# EAGLE board ADS1299-shield (EAGLE 6.5.0)
PCB Matrix Packages
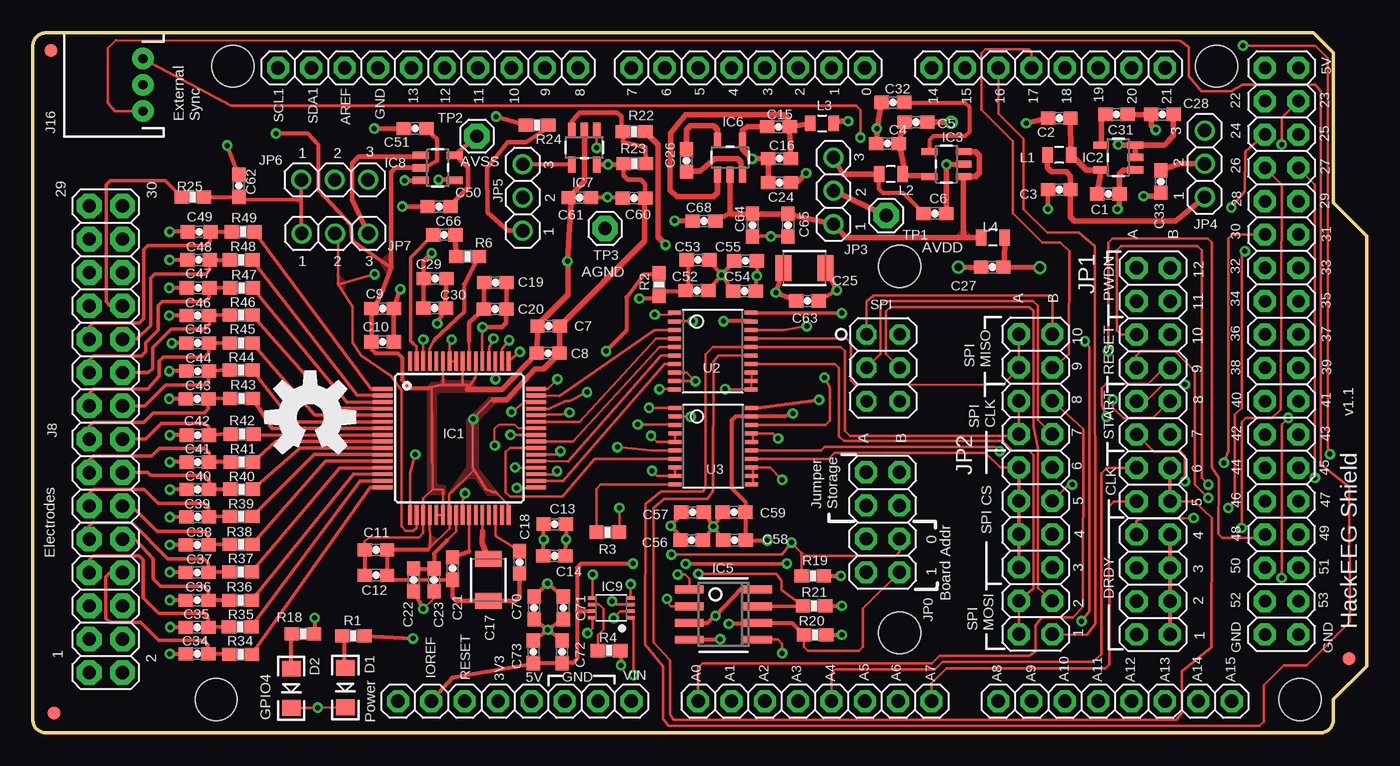
[diagram p3: board, top side]
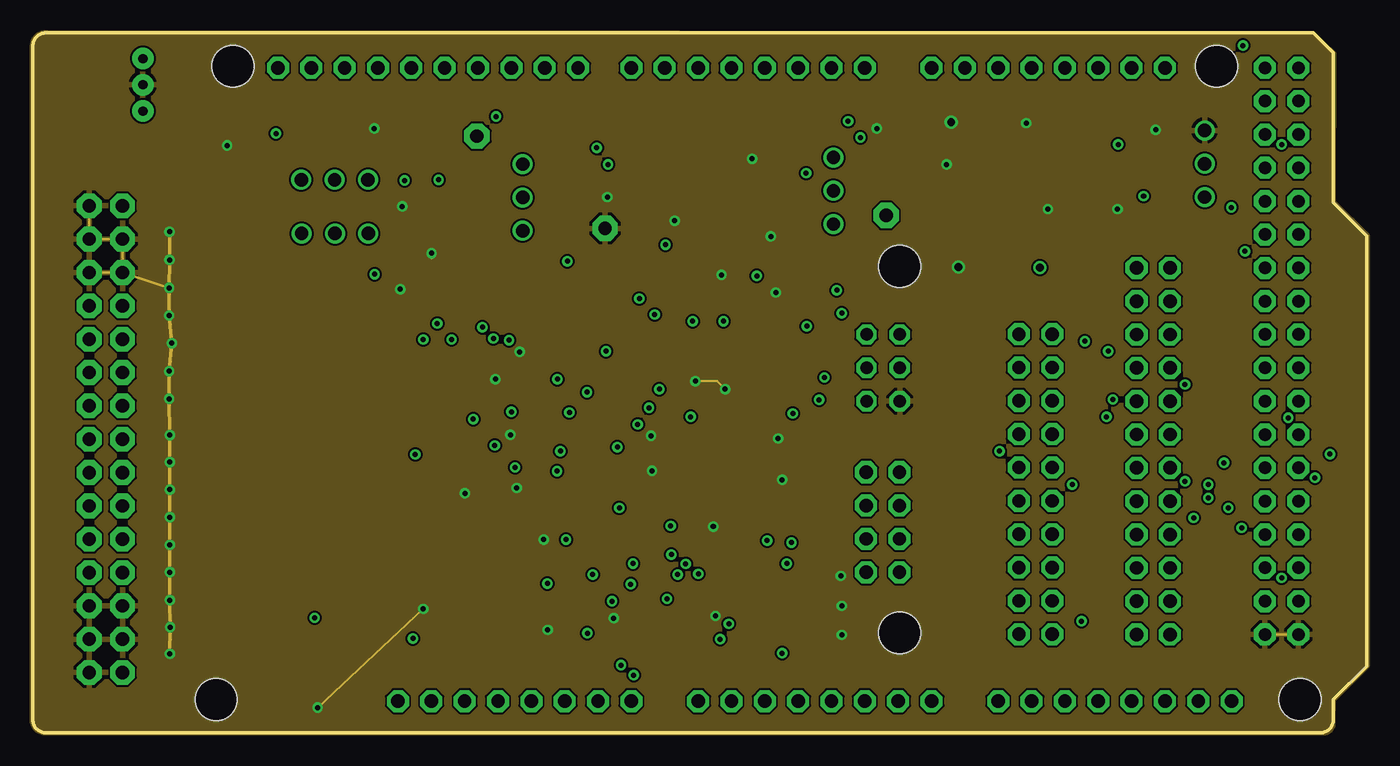
[diagram p4: board, inner layer AGND]
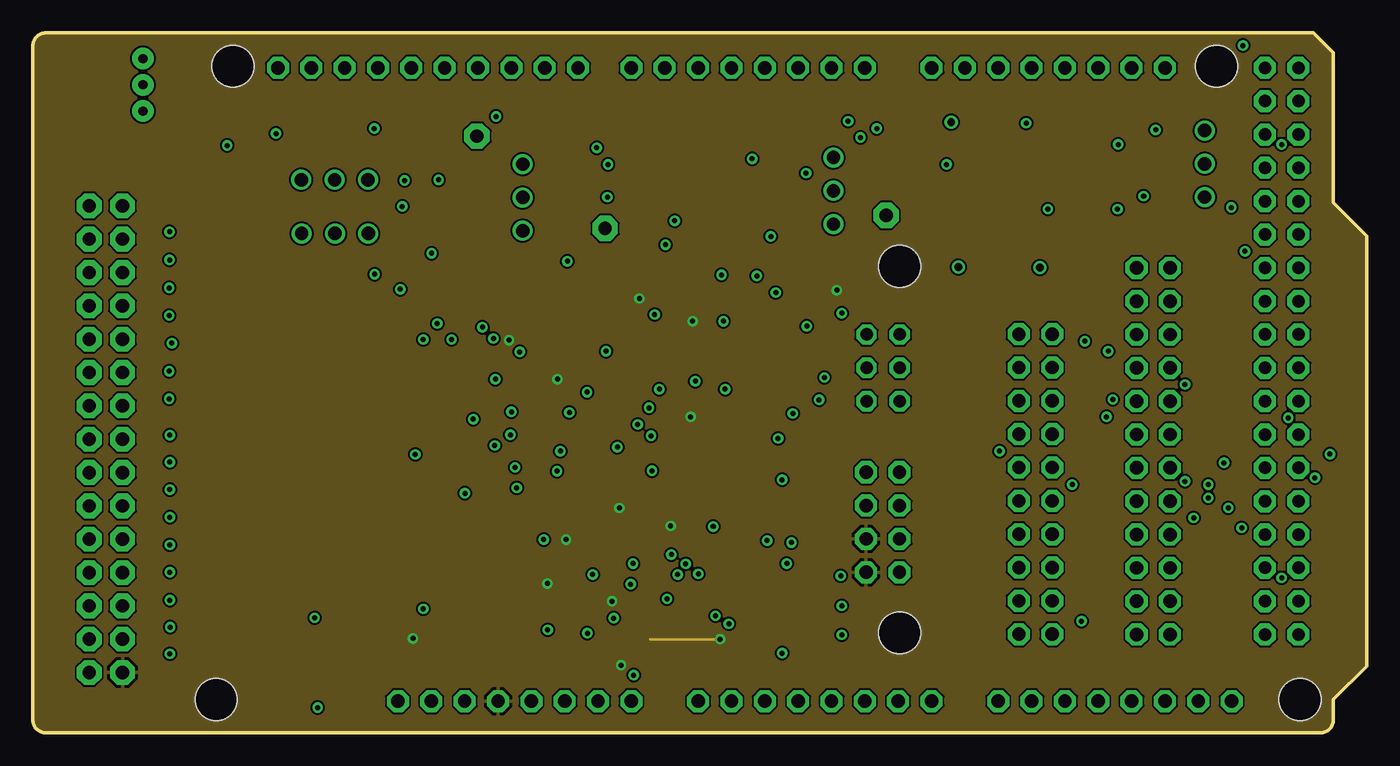
[diagram p5: board, inner layer DVDD]
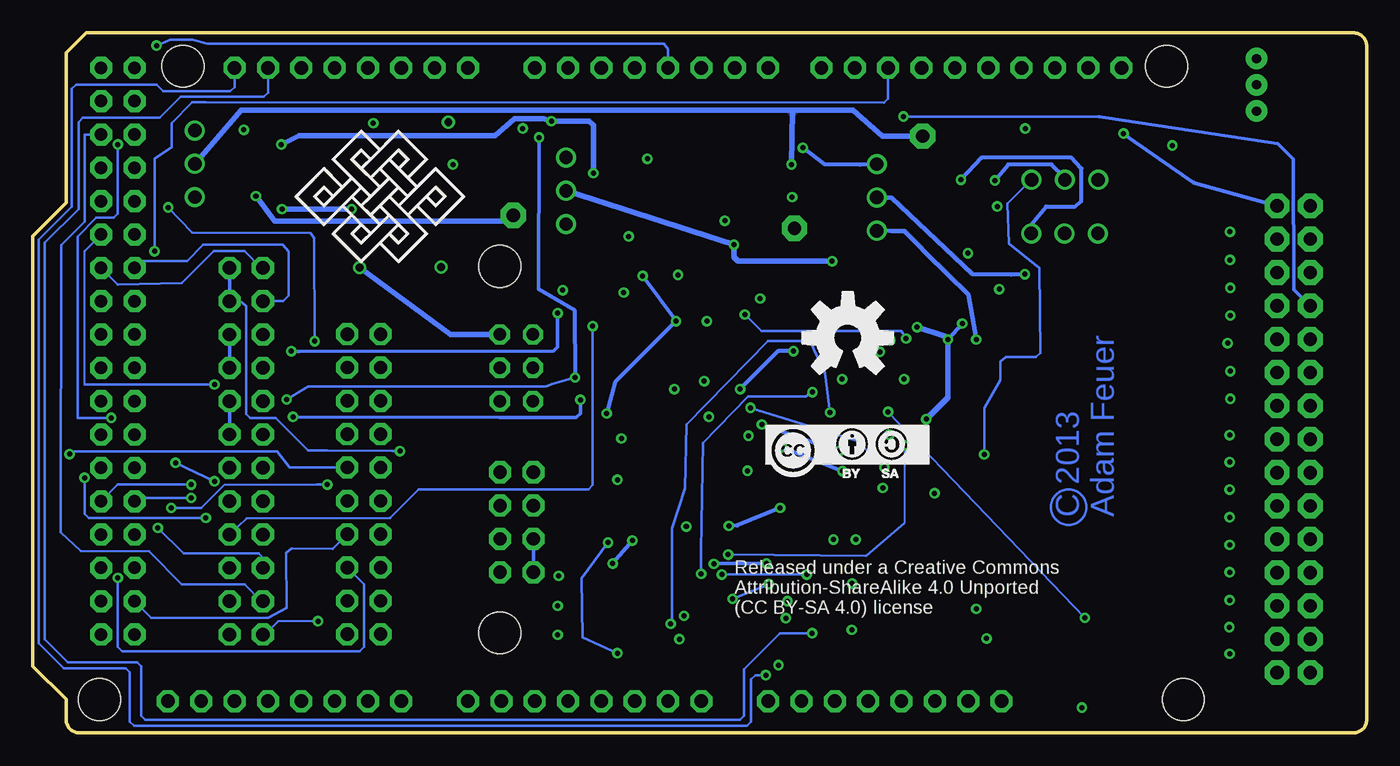
[diagram p6: board, bottom side, seen from below]

Size 101.6 x 53.34 mm. Coordinates in mm from the lower left corner, seen from the top.
Outline: 97.54,53.34 99.06,51.82 99.06,40.39 101.6,37.85 101.6,5.08 99.06,2.54 99.06,1 arc-90 98.06,0 1,0 arc-90 0,1 0,52.34 arc-90 1,53.34 97.54,53.34
Copper layers (1*2+15*16): Top 0.034290625mm / dielectric 12mil / AGND 0.034290625mm / dielectric 59mil / DVDD 0.03301875mm / dielectric 12mil / Bottom 0.034290625mm
Design rules "advanced-circuits-4-layer": minimum track width 6mil, minimum drill 15mil, track to track 6mil, track to pad 6mil, pad to pad 6mil, via to via 6mil, smd to smd 6mil, copper to edge 0mil, drill to drill 6mil, minimum pad ring 10mil, minimum via ring 8mil, stop-mask expansion 4mil, vias tented up to drill 16mil, thermal gap 10mil
Holes 3.2 mm at 96.52,2.54 15.24,50.8 90.17,50.8 13.97,2.54 66.04,35.56 66.04,7.62

## Footprints (pad centres in the part's own frame; a part is rotated, then mirrored left to right if it is on the bottom)
0603-CAP = smd 1.1 x 1: 1 -0.85,0; 2 0.85,0
1210 = smd 1.2 x 2: 1 -1.6,0; 2 1.6,0
LED-1206 = smd 1.2 x 1.4: A -1.5,0; C 1.5,0
TQFP64 = smd 1.5 x 0.285: 1 -5.85,3.75; 2 -5.85,3.25; 3 -5.85,2.75; 4 -5.85,2.25; 5 -5.85,1.75; 6 -5.85,1.25; 7 -5.85,0.75; 8 -5.85,0.25; 9 -5.85,-0.25; 10 -5.85,-0.75; 11 -5.85,-1.25; 12 -5.85,-1.75; 13 -5.85,-2.25; 14 -5.85,-2.75; 15 -5.85,-3.25; 16 -5.85,-3.75; 33 5.85,-3.75; 34 5.85,-3.25; 35 5.85,-2.75; 36 5.85,-2.25; 37 5.85,-1.75; 38 5.85,-1.25; 39 5.85,-0.75; 40 5.85,-0.25; 41 5.85,0.25; 42 5.85,0.75; 43 5.85,1.25; 44 5.85,1.75; 45 5.85,2.25; 46 5.85,2.75; 47 5.85,3.25; 48 5.85,3.75 | smd 0.285 x 1.5: 17 -3.75,-5.85; 18 -3.25,-5.85; 19 -2.75,-5.85; 20 -2.25,-5.85; 21 -1.75,-5.85; 22 -1.25,-5.85; 23 -0.75,-5.85; 24 -0.25,-5.85; 25 0.25,-5.85; 26 0.75,-5.85; 27 1.25,-5.85; 28 1.75,-5.85; 29 2.25,-5.85; 30 2.75,-5.85; 31 3.25,-5.85; 32 3.75,-5.85; 49 3.75,5.85; 50 3.25,5.85; 51 2.75,5.85; 52 2.25,5.85; 53 1.75,5.85; 54 1.25,5.85; 55 0.75,5.85; 56 0.25,5.85; 57 -0.25,5.85; 58 -0.75,5.85; 59 -1.25,5.85; 60 -1.75,5.85; 61 -2.25,5.85; 62 -2.75,5.85; 63 -3.25,5.85; 64 -3.75,5.85
SOT23-5 = smd 0.55 x 1.2: 1 -0.95,-1.3; 2 0,-1.3; 3 0.95,-1.3; 4 0.95,1.3; 5 -0.95,1.3
SO-08 = smd 0.6 x 2.2: 1 -1.905,-2.6; 2 -0.635,-2.6; 3 0.635,-2.6; 4 1.905,-2.6; 5 1.905,2.6; 6 0.635,2.6; 7 -0.635,2.6; 8 -1.905,2.6
VFSOP-8 = smd 0.25 x 0.65: P$1 -0.75,-1.45; P$2 -0.25,-1.45; P$3 0.25,-1.45; P$4 0.75,-1.45; P$5 0.75,1.45; P$6 0.25,1.45; P$7 -0.25,1.45; P$8 -0.75,1.45
2X15 = drill 1.016 pad 1.88 octagon: 1 -17.78,-1.27; 2 -17.78,1.27; 3 -15.24,-1.27; 4 -15.24,1.27; 5 -12.7,-1.27; 6 -12.7,1.27; 7 -10.16,-1.27; 8 -10.16,1.27; 9 -7.62,-1.27; 10 -7.62,1.27; 11 -5.08,-1.27; 12 -5.08,1.27; 13 -2.54,-1.27; 14 -2.54,1.27; 15 0,-1.27; 16 0,1.27; 17 2.54,-1.27; 18 2.54,1.27; 19 5.08,-1.27; 20 5.08,1.27; 21 7.62,-1.27; 22 7.62,1.27; 23 10.16,-1.27; 24 10.16,1.27; 25 12.7,-1.27; 26 12.7,1.27; 27 15.24,-1.27; 28 15.24,1.27; 29 17.78,-1.27; 30 17.78,1.27
JST-3-PTH = drill 0.7 pad 1.626: 1 -2,0; 2 0,0; 3 2,0
2X04 = drill 1.016 pad 1.676 octagon: 1 -3.81,-1.27; 2 -3.81,1.27; 3 -1.27,-1.27; 4 -1.27,1.27; 5 1.27,-1.27; 6 1.27,1.27; 7 3.81,-1.27; 8 3.81,1.27
2X12 = drill 1.016 pad 1.676 octagon: 1 -12.7,1.27; 2 -12.7,3.81; 3 -10.16,1.27; 4 -10.16,3.81; 5 -7.62,1.27; 6 -7.62,3.81; 7 -5.08,1.27; 8 -5.08,3.81; 9 -2.54,1.27; 10 -2.54,3.81; 11 0,1.27; 12 0,3.81; 13 2.54,1.27; 14 2.54,3.81; 15 5.08,1.27; 16 5.08,3.81; 17 7.62,1.27; 18 7.62,3.81; 19 10.16,1.27; 20 10.16,3.81; 21 12.7,1.27; 22 12.7,3.81; 23 15.24,1.27; 24 15.24,3.81
2X10 = drill 1.016 pad 1.676 octagon: 1 -11.43,-1.27; 2 -11.43,1.27; 3 -8.89,-1.27; 4 -8.89,1.27; 5 -6.35,-1.27; 6 -6.35,1.27; 7 -3.81,-1.27; 8 -3.81,1.27; 9 -1.27,-1.27; 10 -1.27,1.27; 11 1.27,-1.27; 12 1.27,1.27; 13 3.81,-1.27; 14 3.81,1.27; 15 6.35,-1.27; 16 6.35,1.27; 17 8.89,-1.27; 18 8.89,1.27; 19 11.43,-1.27; 20 11.43,1.27
1X03 = drill 1.016: 1 -2.54,0; 2 0,0; 3 2.54,0
1X10 = drill 1.016 pad 1.676 octagon: 1 -11.43,0; 2 -8.89,0; 3 -6.35,0; 4 -3.81,0; 5 -1.27,0; 6 1.27,0; 7 3.81,0; 8 6.35,0; 9 8.89,0; 10 11.43,0
1X08 = drill 1.016 pad 1.676 octagon: 1 -8.89,0; 2 -6.35,0; 3 -3.81,0; 4 -1.27,0; 5 1.27,0; 6 3.81,0; 7 6.35,0; 8 8.89,0
2X18 = drill 0.95 pad 1.676 octagon: 1 -21.59,-1.27; 2 -21.59,1.27; 3 -19.05,-1.27; 4 -19.05,1.27; 5 -16.51,-1.27; 6 -16.51,1.27; 7 -13.97,-1.27; 8 -13.97,1.27; 9 -11.43,-1.27; 10 -11.43,1.27; 11 -8.89,-1.27; 12 -8.89,1.27; 13 -6.35,-1.27; 14 -6.35,1.27; 15 -3.81,-1.27; 16 -3.81,1.27; 17 -1.27,-1.27; 18 -1.27,1.27; 19 1.27,-1.27; 20 1.27,1.27; 21 3.81,-1.27; 22 3.81,1.27; 23 6.35,-1.27; 24 6.35,1.27; 25 8.89,-1.27; 26 8.89,1.27; 27 11.43,-1.27; 28 11.43,1.27; 29 13.97,-1.27; 30 13.97,1.27; 31 16.51,-1.27; 32 16.51,1.27; 33 19.05,-1.27; 34 19.05,1.27; 35 21.59,-1.27; 36 21.59,1.27
0805 = smd 0.8 x 1.2: 1 -0.9,0; 2 0.9,0
0603-RES = smd 1.1 x 1: 1 -0.85,0; 2 0.85,0
2X03 = drill 0.95 pad 1.55 octagon: 1 -2.54,-1.27; 2 -2.54,1.27; 3 0,-1.27; 4 0,1.27; 5 2.54,-1.27; 6 2.54,1.27
1X01 = drill 1.016 pad 1.93 octagon: 1 0,0
TSSOP20 = smd 0.305 x 0.991: 1 -2.925,-2.918; 2 -2.275,-2.918; 3 -1.625,-2.918; 4 -0.975,-2.918; 5 -0.325,-2.918; 6 0.325,-2.918; 7 0.975,-2.918; 8 1.625,-2.918; 9 2.275,-2.918; 10 2.925,-2.918; 11 2.925,2.918; 12 2.275,2.918; 13 1.625,2.918; 14 0.975,2.918; 15 0.325,2.918; 16 -0.325,2.918; 17 -0.975,2.918; 18 -1.625,2.918; 19 -2.275,2.918; 20 -2.925,2.918
FIDUCIAL_1MM = smd 1 x 1: 1 0,0

## Placement (x,y rotation side)
C1  2.2uF  [0603-CAP]  81.92,41.07 0 top
C2  10 uF  [0603-CAP]  78.18,46.84 180 top
C3  10uF  [0603-CAP]  78.18,41.4 180 top
C4  2.2uF  [0603-CAP]  65.1,44.91 180 top
C5  10 uF  [0603-CAP]  67.26,46.53 0 top
C6  10uf  [0603-CAP]  68.71,39.57 0 top
C7  1uF  [0603-CAP]  39.29,30.99 0 top
C8  0.1uF  [0603-CAP]  39.24,28.93 0 top
C9  1uF  [0603-CAP]  26.64,32.33 0 top
C10  0.1uF  [0603-CAP]  26.64,29.79 0 top
C11  1uF  [0603-CAP]  26.14,13.94 0 top
C12  0.1uF  [0603-CAP]  26.14,12.01 0 top
C13  1uF  [0603-CAP]  39.75,15.9 180 top
C14  0.1uF  [0603-CAP]  39.73,13.49 180 top
C15  1uF  [0603-CAP]  56.79,46.18 180 top
C16  10 uF  [0603-CAP]  56.87,43.76 180 top
C17  100uF  [1210]  34.7,11.66 270 top
C18  1uF  [0603-CAP]  37.08,13 270 top
C19  1uF  [0603-CAP]  35.23,34.32 0 top
C20  0.1uF  [0603-CAP]  35.2,32.28 0 top
C21  1uF  [0603-CAP]  31.98,12.52 270 top
C22  1uF  [0603-CAP]  29.01,11.66 270 top
C23  1uF  [0603-CAP]  30.56,11.66 270 top
C24  10uf  [0603-CAP]  56.87,41.94 180 top
C25  100uF  [1210]  58.78,35.41 180 top
C26  1uF  [0603-CAP]  49.78,43.61 90 top
C27  10uf  [0603-CAP]  73.08,35.48 180 top
C28  2.2uF  [0603-CAP]  86.03,47.12 180 top
C29  1uF  [0603-CAP]  30.63,34.62 0 top
C30  1uF  [0603-CAP]  30.61,32.36 0 top
C31  0.01uF  [0603-CAP]  82.55,47.12 0 top
C32  1uF  [0603-CAP]  65.51,48.03 180 top
C33  0.1uF  [0603-CAP]  85.93,42.01 90 top
C34  4.7nF  [0603-CAP]  12.52,6.02 180 top
C35  4.7nF  [0603-CAP]  12.52,8.05 0 top
C36  4.7nF  [0603-CAP]  12.52,10.11 180 top
C37  4.7nF  [0603-CAP]  12.52,12.22 0 top
C38  4.7nF  [0603-CAP]  12.52,14.33 180 top
C39  4.7nF  [0603-CAP]  12.55,16.46 0 top
C40  4.7nF  [0603-CAP]  12.57,18.54 180 top
C41  4.7nF  [0603-CAP]  12.57,20.62 0 top
C42  4.7nF  [0603-CAP]  12.57,22.68 180 top
C43  4.7nF  [0603-CAP]  12.52,25.45 0 top
C44  4.7nF  [0603-CAP]  12.55,27.56 180 top
C45  4.7nF  [0603-CAP]  12.55,29.69 0 top
C46  4.7nF  [0603-CAP]  12.57,31.8 180 top
C47  4.7nF  [0603-CAP]  12.6,33.91 0 top
C48  4.7nF  [0603-CAP]  12.62,36.04 180 top
C49  4.7nF  [0603-CAP]  12.67,38.18 0 top
C50  1uF  [0603-CAP]  30.94,40.11 180 top
C51  1uF  [0603-CAP]  29.11,46.05 0 top
C52  1uF  [0603-CAP]  50.6,33.71 180 top
C53  0.1uF  [0603-CAP]  50.67,36.04 180 top
C54  1uF  [0603-CAP]  54.2,33.65 0 top
C55  0.1uF  [0603-CAP]  54.28,35.97 0 top
C56  1uF  [0603-CAP]  50.19,14.68 180 top
C57  0.1uF  [0603-CAP]  50.24,16.81 180 top
C58  1uF  [0603-CAP]  53.44,14.68 0 top
C59  0.1uF  [0603-CAP]  53.42,16.81 0 top
C60  1uF  [0603-CAP]  45.8,40.74 180 top
C61  1uF  [0603-CAP]  41.66,40.79 180 top
C62  4.7nF  [0603-CAP]  15.7,41.68 90 top
C63  0.1uF  [0603-CAP]  59,32.92 180 top
C64  10uF  [0603-CAP]  54.81,38.68 270 top
C65  1 uF  [0603-CAP]  57.53,38.68 270 top
C66  0.01uF  [0603-CAP]  31.34,37.95 0 top
C68  1uF  [0603-CAP]  51.13,38.99 180 top
C70  1uF  [0603-CAP]  38.18,9.52 90 top
C71  0.1uF  [0603-CAP]  40.41,9.52 90 top
C72  1uF  [0603-CAP]  40.31,6.17 270 top
C73  0.1uF  [0603-CAP]  38.13,6.17 270 top
D1  RED  [LED-1206]  23.8,3.45 270 top
D2  WHITE  [LED-1206]  19.69,3.4 270 top
IC1  ADS1299IPAG  [TQFP64]  32.49,22.45 0 top
IC2  TPS72325DBVT  [SOT23-5]  82.68,43.84 90 top
IC3  TPS73225DBVT  [SOT23-5]  69.6,43.33 90 top
IC5  24AA256UID  [SO-08]  52.6,9.02 90 top
IC6  TPS60403DBVT  [SOT23-5]  53.11,43.84 0 top
IC7  OPA376DBV  [SOT23-5]  42.01,44.6 180 top
IC8  OPA376DBV  [SOT23-5]  30.84,43.05 270 top
IC9  TXS0102DCUR  [VFSOP-8]  44.07,9.52 90 top
J8  Electrode Connector  [2X15]  5.56,22.38 90 top
J16  EXTERNAL_SYNC  [JST-3-PTH]  8.38,49.38 90 top
JP0  BOARD_ADDRESS  [2X04]  64.74,16.05 90 top
JP1  CONFIG1  [2X12]  87.88,20.19 90 top
JP2  CONFIG0  [2X10]  76.38,18.95 270 top
JP3  5V-2.5V  [1X03]  60.99,41.3 90 top
JP4  -2.5V-GND  [1X03]  89.26,43.36 90 top
JP5  SRB1-BIAS  [1X03]  37.31,40.79 90 top
JP6  SRB2-REF_ELEC  [1X03]  22.99,42.14 0 top
JP7  SRB1-REF_ELEC  [1X03]  23.01,38.05 0 top
JP8  PWMH  [1X10]  30.1,50.67 0 top
JP9  PWML  [1X08]  54.48,50.67 0 top
JP10  COMMUNICATION  [1X08]  77.34,50.67 0 top
JP11  XIO  [2X18]  95.12,29.08 270 top
JP12  ADCH  [1X08]  82.42,2.41 0 top
JP13  ADCL  [1X08]  59.56,2.41 0 top
JP14  POWER  [1X08]  36.7,2.41 0 top
L1  3.3 uH  [0805]  78.18,44.04 180 top
L2  3.3 uH  [0805]  65.35,42.57 180 top
L3  3.3 uH  [0805]  60.12,46.43 0 top
L4  3.3 uH  [0805]  73.13,37.74 180 top
R1  270  [0603-RES]  24.41,7.39 180 top
R2  10k  [0603-RES]  47.7,34.16 90 top
R3  10k  [0603-RES]  43.79,15.29 180 top
R4  10k  [0603-RES]  43.89,6.27 180 top
R6  3.98K  [0603-RES]  33.12,36.3 0 top
R18  270  [0603-RES]  20.57,7.54 180 top
R19  10k  [0603-RES]  59.41,11.96 180 top
R20  10k  [0603-RES]  59.59,7.47 180 top
R21  10k  [0603-RES]  59.51,9.68 180 top
R22  2M  [0603-RES]  45.8,45.8 0 top
R23  2M  [0603-RES]  45.85,43.38 0 top
R24  4.99k  [0603-RES]  38.4,46.3 0 top
R25  4.99k  [0603-RES]  12.19,40.82 180 top
R34  4.99k  [0603-RES]  15.82,5.99 180 top
R35  4.99k  [0603-RES]  15.8,8.08 180 top
R36  4.99k  [0603-RES]  15.82,10.11 180 top
R37  4.99k  [0603-RES]  15.82,12.27 180 top
R38  4.99k  [0603-RES]  15.87,14.35 180 top
R39  4.99k  [0603-RES]  15.87,16.48 180 top
R40  4.99k  [0603-RES]  15.9,18.57 180 top
R41  4.99k  [0603-RES]  15.93,20.62 180 top
R42  4.99k  [0603-RES]  15.95,22.76 180 top
R43  4.99k  [0603-RES]  15.9,25.48 180 top
R44  4.99k  [0603-RES]  15.87,27.64 180 top
R45  4.99k  [0603-RES]  15.87,29.69 180 top
R46  4.99k  [0603-RES]  15.87,31.83 180 top
R47  4.99k  [0603-RES]  15.9,33.91 180 top
R48  4.99k  [0603-RES]  15.87,36.04 180 top
R49  4.99k  [0603-RES]  16.03,38.18 180 top
SPI  SPI  [2X03]  64.77,27.81 270 top
TP1  AVDD_TEST_POINT  [1X01]  65,39.42 90 top
TP2  AVSS_TEST_POINT  [1X01]  33.83,45.47 0 top
TP3  AGND_TEST_POINT  [1X01]  43.59,38.43 0 top
U2  TXB0108PWR  [TSSOP20]  51.79,29.08 270 top
U3  TXB0108PWR  [TSSOP20]  51.82,21.84 270 top
U$1  [OSHW-LOGO-L]  21.13,24.05 0 top
U$2  FIDUCIAL  [FIDUCIAL_1MM]  1.6,1.5 0 top
U$3  [CC-BY-SA]  45.9,19.15 0 bottom
U$4  [OSHW-LOGO-L]  39.52,30.1 0 bottom
U$5  FIDUCIAL  [FIDUCIAL_1MM]  1.37,51.99 0 top
U$6  FIDUCIAL  [FIDUCIAL_1MM]  100.25,5.66 0 top
U$7  [ENDLESSKNOT-MEDIUM]  75.06,40.82 0 bottom

## Tracks (layer width: path | path; a pad name or v marks a point on that pad's centre or on a via)
!ADC_CS_0  (via drill 0.38)
  Top 0.203: v92.18,52.38 97.69,52.35 98.63,51.41 98.63,21.64 v98.81,21.23
  Bottom 0.203: JP9.4 53.21,52.08 53.5,52.5 88.32,52.5 89.41,52.81 91.14,52.81 v92.18,52.38 | v98.81,21.23 98.48,21.44 83.01,21.44 82.04,20.22 JP2.10
!ADC_CS_1  (via drill 0.38)
  Top 0.152: v92.33,36.7 92.08,36.45
  Top 0.203: v79.17,18.92 78.77,18.8 JP2.12 | v91.06,17.14 91.57,17.65 91.57,24.26 92.08,24.77 92.08,36.45
  Bottom 0.152: 79.88,18.92 87,18.92 88.77,17.14
  Bottom 0.203: JP8.8 36.45,48.32 36.77,48.01 88.42,48.06 89.45,48.06 91.03,46.47 91.03,44.61 92.33,43.75 v92.33,36.7 | 79.96,18.92 79.88,18.92 v79.17,18.92 | v91.06,17.14 88.77,17.14
!ADC_CS_2
  Bottom 0.203: JP2.14 78.77,14.02 81.9,14.05 82.3,13.73 82.27,9.52 83.69,8.76 92.58,8.76 JP11.33
!ADC_CS_3  (via drill 0.38)
  Top 0.203: JP11.4 95.12,46.86 v95.12,44.83 | v95.63,24 95.12,23.5 v95.12,11.81
  Bottom 0.203: JP2.16 76.38,11.33 76.38,6.54 76.7,6.22 94.81,6.22 95.12,6.54 v95.12,11.81 | v95.12,44.83 95.12,39.56 95.44,39.24 96.77,39.24 98.17,37.82 98.17,24 v95.63,24
!ADC_PWDN_0
  Bottom 0.203: JP11.13 93.34,35.94 89.84,35.94 88.62,37.19 82.58,37.21 82.12,36.65 82.12,33.31 82.54,32.89 JP1.22
!ADC_PWDN_1
  Bottom 0.152: 84.2,35.43 JP1.24
  Bottom 0.203: JP11.14 95.12,34.16 90.25,34.27 87.81,36.7 85.47,36.7 84.2,35.43
!ADC_RESET_0  (via drill 0.38)
  Top 0.203: v89.54,17.91 88.52,18.92 88.52,27.56 87,29.08 84.39,29.08 84.07,28.77 JP1.18
  Bottom 0.152: 93.6,17.91 JP11.27
  Bottom 0.203: v89.54,17.91 93.6,17.91
!ADC_RESET_1  (via drill 0.38)
  Top 0.203: v89.54,18.92 89.03,19.43 89.03,36.77 88.71,37.08 82.89,37.08 82.58,36.77 82.58,30.67 82.89,30.35 JP1.20
  Bottom 0.203: JP11.28 95.12,18.92 v89.54,18.92
!ADS_PWDN  (via drill 0.38)
  Top 0.203: U3.15 54.8,21.51 60.05,21.51 60.3,21.79 73.3,21.79 v73.64,21.46
  Bottom 0.203: JP1.21 85.79,32.89 85.34,32.52 85.34,24.3 85.03,23.98 83.11,23.98 80.65,21.51 79.18,21.51 74.24,21.46 v73.64,21.46
  Bottom 0.254: JP1.23 JP1.21
!ADS_RESET  (via drill 0.38)
  Top 0.203: 81.78,24.08 v81.79,24.08 81.43,24.99 81.43,26.28 81.75,26.59 84.91,26.59 86.13,27.81 JP1.17
  Top 0.254: U3.20 55.22,24.77 v59.89,25.38
  Bottom 0.254: JP1.19 JP1.17 | v59.89,25.38 59.89,24.35 60.21,24.03 66.06,24.03 v81.79,24.08
!ADS_SPI_CS
  Top 0.203: JP2.9 73.69,20.22 72.57,21.34 61.06,21.34 60.59,20.87 U3.14
  Top 0.254: JP2.9 JP2.11 JP2.13 JP2.15
!PWDN  (via drill 0.38)
  Top 0.203: U3.6 47.12,21.51 v44.53,21.77 | v39.93,19.94 39.69,19.7 IC1.35
  Bottom 0.305: v44.53,21.77 v39.93,19.94
!RESET  (via drill 0.38)
  Top 0.203: U3.1 v46.94,24.77 | v36.73,20.22 IC1.36
  Bottom 0.203: v46.94,24.77 38.79,22.23 v36.73,20.22
!SPI_CS
  Top 0.203: U3.7 42.77,20.88 40.34,18.01 36.34,18.01 36.02,18.33 36.02,21.39 36.34,21.7 IC1.39
+2.5V
  Top 0.305: C6.1 66.31,41.12 64.77,41.12 64.45,41.44 L2.2
  Top 0.406: JP3.3 61.72,42.57 L2.2
-2.5V
  Top 0.406: JP4.1 87.02,38.99 79.35,38.99 79.03,39.31 C3.1 79.03,42.43 78.71,42.75 77.6,42.75 77.28,43.07 L1.2
ADC_CLK_0
  Top 0.203: JP1.10 82.33,17.65 81.97,17.21 82.02,5.22 81.7,4.9 69.6,4.9 68.45,3.76 JP13.8
ADC_CLK_1
  Top 0.203: JP1.12 81.8,20.19 81.41,19.77 81.41,5.98 80.73,5.41 69.29,5.41 68.71,4.83 61.15,4.83 60.83,4.51 JP13.5
ADC_DRDY_0  (via drill 0.38)
  Top 0.203: v79.88,8.51 80.47,9.27 80.47,29.41 v80.14,29.85 | v91.29,40.03 92.33,41.27 92.35,44.3 JP11.5
  Bottom 0.152: v79.88,8.51 82.93,8.51 83.95,7.49 JP1.2
  Bottom 0.203: v80.14,29.85 80.16,37.68 80.45,38.07 89.46,38.1 v91.29,40.03
ADC_DRDY_1
  Bottom 0.203: JP11.6 97.66,45.59 97.66,38.94 99.44,37.16 99.47,15.26 97.97,13.87 92.73,13.84 90.27,11.3 85.47,11.3 84.2,10.03 JP1.4
ADC_DRDY_2  (via drill 0.38)
  Top 0.203: JP11.7 95.12,41.78 95.05,24.64 94.39,24 92.39,24 92.08,23.69 v92.08,15.62
  Bottom 0.203: JP1.6 84.07,13.35 84.39,13.66 90.12,13.66 v92.08,15.62
ADC_DRDY_3  (via drill 0.38)
  Top 0.203: JP1.8 84.07,16.14 84.49,16.36 87.63,16.36 v88.42,16.38 | JP11.8 97.66,41.78 v97.66,19.43
  Bottom 0.203: v88.42,16.38 97.34,16.38 97.66,16.7 v97.66,19.43
ADC_START_0  (via drill 0.38)
  Top 0.203: JP11.11 91.38,37.97 91.06,37.65 91.06,21.46 v90.73,20.57 | JP1.14 85.37,21.44 87.43,21.44 87.76,21.11 v87.76,19.18
  Bottom 0.203: v90.73,20.57 89.18,19.84 v87.76,19.18
ADC_START_1  (via drill 0.38)
  Top 0.203: v87.76,26.54 86.08,26.54 84.81,25.27 JP1.16
  Bottom 0.152: 97.66,26.54 97.66,36.7
  Bottom 0.203: 97.66,36.7 JP11.12 | v87.76,26.54 97.66,26.54
ADS_CLK
  Top 0.203: U2.15 52.21,28.76 51.84,28.31 51.82,18.45 51.4,17.83 48.09,17.83 47.29,17.13 47.29,6.91 48.54,5.54 48.54,1.41 48.81,0.99 87.08,1.02 87.5,1.54 87.5,4.7 89.76,6.53 89.79,16.4 88.45,17.65 JP1.9
  Top 0.254: JP1.9 JP1.11
ADS_CLKSEL  (via drill 0.38)
  Top 0.203: U2.20 54.74,31.98 | JP11.29 93.65,15.11 93.4,14.86 90.62,14.86 90.3,15.18 90.32,19.43 89.79,20.22 89.81,32.74 89.81,37.35 89.5,37.67 82.23,37.67 81.92,37.35 v81.92,29.08
  Top 0.254: 54.74,31.98 v61.62,31.98
  Bottom 0.254: v61.62,31.98 61.62,29.4 61.94,29.08 81.33,29.06 81.42,29.06 v81.92,29.08
ADS_DRDY  (via drill 0.38)
  Top 0.203: U2.18 54.68,30.68 57.23,30.68 v58.95,30.99
  Top 0.305: JP1.7 JP1.5 JP1.3 JP1.1
  Bottom 0.203: JP1.7 85.29,16.36 74.37,16.38 72.21,18.57 59.27,18.57 58.95,18.89 v58.95,30.99
ADS_SPI_CLK
  Top 0.203: JP2.5 JP2.7 74.65,22.63 62.24,22.63 61.85,23 61.85,29.09 61.53,29.41 U2.16 51.8,29.41 51.23,28.84 51.23,18.71 51.04,18.39 47.84,18.39 46.66,17.46 46.63,6.73 48.01,5.06 48.01,1.08 48.42,0.56 90.81,0.53 93.43,0.53 93.75,0.85 93.75,3.63 95.28,5.16 97.03,5.16 100.33,8.46 100.28,18.75 98.12,20.45 98.12,48.88 97.68,49.4 92.13,49.4 91.29,48.89 88.99,48.89 88.06,50.02 88.06,52.26 87.41,52.76 6.31,52.78 5.71,52.16 5.71,48 6.24,47.38 J16.1
ADS_SPI_IN
  Top 0.203: JP2.19 JP2.17 76.2,11 76.2,21.17 75.86,21.51 74.6,21.51 73.89,22.23 61.79,22.23 61.42,22.59 61.42,27.79 61.1,28.11 U2.14
ADS_SPI_OUT
  Top 0.203: JP2.1 JP2.3 73.89,26.52 64.39,26.54 62.62,26.54 62.31,26.86 62.31,29.74 61.99,30.06 U2.17
ADS_START  (via drill 0.38)
  Top 0.203: 54.76,23.44 U3.18 60.39,23.47 60.71,23.79 60.71,26.31 v60.3,27.08 | v63.04,45.36 63.04,47.46 62.72,47.78 15.11,47.78 J16.3 | JP1.15 85.32,23.98 83.06,23.98 82.27,24.77 v82.27,25.4
  Bottom 0.203: v82.27,25.4 80.62,26.39 62.51,26.39 62.05,26.57 v60.3,27.08
  Bottom 0.254: JP1.15 JP1.13 | v63.04,45.36 63.09,33.83 60.35,32.21
  Bottom 0.305: 60.35,32.21 v60.3,27.08
AGND  (via drill 0.38, 0.6)
  Top 0.152: 54.86,22.23 U3.16 | 54.86,22.73 U3.17 | 54.86,19.69 U3.12 54.86,19.43 | 54.86,20.19 U3.13 | 54.74,26.8 54.74,26.29 U2.11 | 54.74,26.8 54.74,27.56 U2.13 | 54.74,26.8 U2.12 | 69.67,43.31 v69.6,43.31 | 54.86,18.92 U3.11 | 51.7,15.88 51.69,15.87 v51.83,15.72
  Top 0.203: v52.73,26.19 53.27,26.16 U2.11 | D1.C v21.69,1.93 D2.C | IC1.41 v36.37,22.71 | v32.92,18.26 32.74,17.68 IC1.25 | C57.1 51.28,16.74 51.18,16.84 | IC1.33 38.3,18.67 v36.85,18.67 | 82.64,39.9 v82.63,39.9 | U2.9 49.14,26.81 49.15,26.8 v50.47,26.8 | U2.8 49.81,27.46 v50.47,26.8 | 54.86,22.73 54.86,22.23 | 54.86,20.19 54.86,19.69 | 54.86,18.92 54.86,19.43 | 50.67,26.8 v50.47,26.8 | U3.4 U3.5 47.55,22.17 v47.09,22.63 | v47.17,19.96 47.56,19.57 U3.9 U3.8 | U3.13 56.13,20.22 v57.07,19.28 | U3.17 56.38,22.82 v56.77,22.43 | IC1.49 v37.08,29.03 | IC1.51 v35.23,26.95 | 30.56,10.59 30.56,10.26 v29.74,9.45 | IC9.P$2 44.73,9.27 v44.25,8.74
  Top 0.254: C40.2 11.53,18.9 | C64.2 v56.21,37.83 | C65.2 v56.21,37.83 | v56.21,37.83 v56.21,37.82
  Top 0.305: C35.1 v10.46,8.05 | v10.44,6.02 C34.2 | C36.2 v10.44,10.11 | C37.1 v10.44,12.24 | C38.2 v10.44,14.33 | C39.1 v10.44,16.43 | C40.2 v10.44,18.54 | C41.1 v10.44,20.62 | C42.2 v10.44,22.68 | C43.1 v10.39,25.45 | C44.2 v10.39,27.56 | C45.1 v10.59,29.69 | C46.2 v10.39,31.8 | C47.1 v10.39,33.91 | C48.2 v10.41,36.04 | C49.1 v10.41,38.18 | C22.2 v29.74,9.45 | C53.1 v52.45,34.9 | C52.1 v52.45,34.9 | C55.1 v52.45,34.9 | C54.1 v52.45,34.9 | C59.1 v51.83,15.72 | C58.1 v51.83,15.72 | v51.83,15.72 C56.1 | 51.18,16.84 51.7,15.88 51.79,15.72 | C62.2 v14.81,44.75 | C13.2 v38.91,14.73 C14.2 | C23.2 30.56,10.59 | C70.1 v39.22,7.85 | C73.1 v39.22,7.85 | C72.1 v39.22,7.85 | C71.1 v39.22,7.85 | 55.24,10.85 IC5.4 53.9,10.92 v51.99,8.91 51.36,8.38 IC5.7 | R19.1 v61.54,11.96 | R21.1 v61.62,9.68 | R20.1 v61.62,7.47
  Top 0.356: v27.99,33.81 C9.2 C10.2 | C50.2 v28.14,40.11 | C3.2 v77.32,39.9 | C61.1 v43.76,40.82 C60.2 | C51.1 v26.01,46.05 | C30.1 C29.1 29.78,35.95 v30.38,36.55 | C25.2 v56.59,33.55 C63.2 | C65.2 57.52,37.82
  Top 0.406: IC3.2 v69.6,43.31 69.6,40.32 C6.2 | C2.2 v75.67,46.46 | C24.2 C16.2 v54.79,43.74 54.06,44.46 IC6.4 54.06,45.94 54.43,46.18 C15.2 | C32.2 v64.29,46.05 C4.2 | C31.2 C28.2 85.18,46.27 v85.52,45.95 | v82.63,39.9 82.77,40.04 C1.2 82.77,42.57 83.08,42.89 IC2.1 | C27.2 71.4,35.46 v70.51,35.48 | C68.2 v48.89,39.01 | C5.2 v69.95,46.53
  AGND 0.203: 52.73,25.96 v52.73,26.19 52.12,26.8 v50.47,26.8 | v21.69,1.93 v29.74,9.45 | v51.83,15.72 v51.83,15.73 | JP11.36 JP11.35 | J8.30 J8.28 J8.27 J8.25 | J8.26 J8.25 | J8.25 v10.39,33.91 | v37.08,29.03 36.96,29.03 | v35.23,26.95 35.23,27.1 | v30.38,36.55 30.38,36.2
  AGND 0.254: v10.44,6.02 v10.46,8.05 v10.44,10.11 v10.44,12.24 v10.44,14.33 v10.44,16.43 v10.44,18.54 v10.44,20.62 v10.44,22.68 v10.39,25.45 v10.39,27.56 v10.59,29.69 v10.39,31.8 v10.39,33.91 v10.41,36.04 v10.41,38.18
  AGND 0.356: v56.59,33.55 56.52,33.35
  AGND 0.406: v69.95,46.53 69.91,46.53
  Bottom 0.406: v77.32,39.9 v82.63,39.9
  pour AGND: -0.03,52.3 -0.05,1.12 -0.05,1.07 arc90 1.02,0 98.22,0 98.27,0 arc90 99.03,0.76 99.06,2.54 101.63,5.13 101.63,37.85 99.06,40.41 99.09,51.77 97.49,53.29 1.04,53.34 1.02,53.34 arc90
AIN1N
  Top 0.254: J8.8 4.29,13.17 4.61,13.49 8.09,13.49 8.41,13.17 8.41,10.29 9.6,9.09 13.05,9.09 13.37,8.78 C35.2
  Top 0.305: R35.2 C35.2
AIN1P
  Top 0.254: J8.7 5.88,12.22 5.56,11.9 5.56,8.72 5.88,8.41 8.2,8.41 9.58,7.04 13.05,7.04 13.37,6.72 C34.1
  Top 0.305: R34.2 C34.1
AIN2N
  Top 0.254: J8.10 4.29,15.76 4.61,16.03 7.57,16 10.26,13.26 13.05,13.26 13.37,12.94 C37.2
  Top 0.305: R37.2 C37.2
AIN2P
  Top 0.254: J8.9 7.75,14.78 9.17,13.26 9.17,11.73 9.75,11.15 13.05,11.15 13.37,10.83 C36.1
  Top 0.305: R36.2 C36.1
AIN3N
  Top 0.254: J8.12 4.29,18.25 4.61,18.57 8.48,18.57 9.55,17.5 13.08,17.5 13.4,17.18 C39.2
  Top 0.305: R39.2 C39.2
AIN3P
  Top 0.254: J8.11 7.54,17.3 9.47,15.37 13.05,15.37 13.37,15.05 C38.1
  Top 0.305: R38.2 C38.1
AIN4N
  Top 0.254: J8.14 4.29,20.79 4.61,21.11 9.07,21.11 9.63,21.67 13.1,21.67 13.42,21.35 C41.2
  Top 0.305: R41.2 C41.2
AIN4P
  Top 0.254: J8.13 8.76,19.84 8.99,19.61 13.1,19.61 13.42,19.29 C40.1
  Top 0.305: R40.2 C40.1
AIN5N
  Top 0.254: J8.16 4.29,23.33 4.61,23.65 8.46,23.65 9.17,24.36 13.05,24.36 13.37,24.68 C43.2
  Top 0.305: R43.2 C43.2
AIN5P
  Top 0.254: C42.1 13.42,23.25 13.1,23.57 9.78,23.57 8.58,22.38 J8.15
  Top 0.305: R42.2 C42.1
AIN6N
  Top 0.254: R45.2 C45.2 13.4,28.97 13.08,28.65 9.94,28.65 9.63,28.33 9.63,27.2 8.76,26.19 4.58,26.19 4.29,25.84 J8.18
AIN6P
  Top 0.254: J8.17 8.53,24.92 10.11,26.49 13.08,26.49 13.4,26.81 C44.1
  Top 0.305: R44.2 C44.1
AIN7N
  Top 0.254: J8.20 4.29,28.41 4.61,28.73 8.27,28.73 8.58,29.05 8.58,29.74 9.55,30.71 9.55,32.55 9.87,32.87 13.13,32.87 13.45,33.18 C47.2
  Top 0.305: R47.2 C47.2
AIN7P
  Top 0.254: J8.19 8.8,27.46 9.12,27.78 9.12,29.36 10.54,30.79 13.1,30.79 13.42,31.1 C46.1
  Top 0.305: R46.2 C46.1
AIN8N
  Top 0.254: J8.22 4.29,30.93 4.61,31.24 8.12,31.24 8.43,31.56 8.43,36.82 8.75,37.13 13.21,37.13 13.52,37.45 C49.2
  Top 0.305: C49.2 R49.2
AIN8P
  Top 0.254: J8.21 7.92,30 8.97,31.04 8.97,34.66 9.28,34.98 13.16,34.98 13.47,35.29 C48.1
  Top 0.305: C48.1 R48.2
ARD_SCL  (via drill 0.38)
  Top 0.203: v45.77,4.39 45.77,8.52 IC9.P$1
  Bottom 0.203: JP10.8 86.23,49.21 86.55,48.89 91.67,48.89 92.18,49.4 98.31,49.4 98.63,49.09 98.63,40.11 101.17,37.57 101.17,6.83 99.26,4.93 94.53,4.93 94.21,4.61 94.21,0.85 93.89,0.53 47.21,0.53 46.89,0.85 46.89,4.08 46.57,4.39 v45.77,4.39
ARD_SDA  (via drill 0.38)
  Top 0.203: v42.24,7.6 42.62,7.97 IC9.P$8
  Bottom 0.203: JP10.7 83.69,48.78 84.01,48.46 90.32,48.46 91.92,46.86 97.8,46.86 98.12,46.54 98.12,39.9 100.69,37.34 100.69,7.11 98.96,5.38 93.66,5.38 93.34,5.07 93.34,1.31 93.03,0.99 47.74,0.99 47.42,1.31 47.42,4.85 44.68,7.6 v42.24,7.6
AVDD  (via drill 0.38)
  Top 0.152: 41.02,41.02 C61.2 40.77,40.77 | 46.86,45.59 R22.2 | 38.48,31.12 C7.1 | IC8.2 29.85,43.05 | 26.04,32.38 C9.1 | 33.76,28.32 IC1.54
  Top 0.203: 25.46,13.94 C11.1 25.29,14.59 25.6,14.91 29.42,14.91 29.74,15.23 IC1.19 29.74,17.85 30.46,18.57 | C10.1 25.78,29.78 | 41.99,45.64 IC7.2 42.04,46.1 | 30.15,26.29 30.36,26.34 | 30.36,26.34 31.02,26.49 | 31.02,26.49 31.24,26.54 IC1.59 | IC1.54 33.74,27.11 33.12,26.16 33.12,26.49 32.59,26.49 | 32.59,26.49 31.02,26.49 | 30.46,18.57 31.24,18.52 IC1.22 IC1.21 | 30.46,18.57 30.36,26.34 | IC1.56 32.74,26.64 32.59,26.49
  Top 0.305: 25.78,29.78 25.78,29.25 26.1,28.93 27.8,28.93 28.12,28.61 28.12,26.91 28.64,26.29 30.15,26.29 | 27.3,35.43 24.36,37.46 24.26,38.68 21.77,41.35 21.77,44.77 20.97,45.67 v18.52,45.67 | C11.1 C12.1
  Top 0.356: C9.1 C10.1 | 29.85,43.05 30.81,43.61 30.81,45.24 30.1,45.85 C51.2 | IC8.2 27.62,43.05 27.3,42.73 27.3,35.43 26.67,33.81 26.04,32.38
  Top 0.406: C7.1 C8.1 35.73,26.16 33.12,26.16 | 46.86,45.59 47.62,44.83 47.62,37.78 v48.2,37.19 47.99,37.39 47.99,37.4 | 38.48,31.12 40.77,33.4 40.77,35.94 v40.72,35.94 41.02,41.02 | 42.04,46.1 42.04,42.02 C61.2 | v84.61,40.89 85.97,40.89 C33.1 | JP3.2 TP1.1
  Bottom 0.305: v18.52,45.67 13.18,41.93 J8.29
  Bottom 0.406: v40.72,35.94 47.88,35.94 48.2,36.26 v48.2,37.19 JP3.2 | v84.61,40.89 83.19,38.99 65.91,38.99 TP1.1
  pour Top: 30.05,26.29 30.05,18.26 30.15,18.16 31.34,18.16 31.47,18.26 31.47,18.77 31.37,18.87 30.96,18.87 30.76,19.08 30.76,25.76 30.96,25.96 33.4,25.96 33.78,26.06 33.76,26.31 33.48,26.8 32.94,26.8 32.74,27 32.49,26.8 31.47,26.8 31.24,27 30.96,26.7 30.35,26.7
  pour Top: 26.49,36.04 27.33,36.65 27.46,35.43 27.1,34.72 26.39,36.04
AVSS  (via drill 0.38)
  Top 0.152: 40.26,31.12 C7.2 | 46.61,40.51 C60.1 | 36.2,16.64 IC1.32 | 31.73,16.64 IC1.23 | 40,28.83 C8.2 | 31.37,39.75 31.62,40 C50.1 31.88,40.26 | 32.38,43.81 IC8.5 | v43.81,43.31 v43.81,43.3
  Top 0.203: 44.92,43.3 R23.1 | 35.13,25.38 34.98,25.43 v33.55,23.9 | v33.55,23.9 33.5,23.85 33.5,20.19 33.6,20.04 | 33.6,20.04 34.52,18.57 35.03,18.36 35.23,18.36 36.2,17.4 36.2,16.64 IC1.32 | 31.73,16.64 31.73,18.16 33.6,20.04 | v31.9,29.97 31.74,29.81 IC1.58 IC1.57 | v33.55,23.9 v33.55,23.91 33.74,24.1 | IC1.53 34.24,29.92 v34.24,30.91 | IC1.23 31.74,15.58 30.28,14.12 | 30.28,14.12 30.1,13.94 | IC1.20 30.28,14.12
  Top 0.254: C21.2 27.35,11.67
  Top 0.305: 27.35,11.67 C12.2 C11.2 30.1,13.94 | C30.2 v30.81,31.19
  Top 0.356: R23.1 45,42.46 45.31,42.14 46.33,42.14 46.65,41.82 C60.1 | IC7.5 v43.81,43.3 44.92,43.3 | C29.2 C30.2 | 32.38,43.81 33.15,43.05 33.15,41.53 31.88,40.26 | TP2.1 IC8.5 | C18.2 37.08,10.38 36.77,10.06 C17.2 32.3,10.06 31.98,10.38 C21.2 | v34.24,30.91 35.74,30.91 36.05,31.23 C20.2 36.08,32.31 C19.2
  Top 0.406: C7.2 C8.2 | JP4.2 87.36,43.38 C33.2 | 40.26,31.12 46.61,37.46 46.61,40.51 | 40,28.83 38.91,27.74 38.25,27.74 36.09,25.38 35.13,25.38
  Bottom 0.305: v30.81,31.19 v31.9,29.97
  Bottom 0.406: 43.74,47.45 39.14,47.45 36.88,45.47 TP2.1 | 43.74,47.45 85.73,47.45 89.23,43.38 JP4.2 | 43.74,47.45 v43.81,43.31 | v33.55,23.9 31.9,25.55 v31.9,29.97 32.18,30.25 v34.24,30.91
  pour Top: 36.09,25.58 35.61,25.48 33.91,23.75 33.91,20.19 35.15,18.59 35.56,18.08 34.62,18.08 33.93,19 33.68,19.38 33.07,19.38 31.98,18.26 31.67,18.26 33.1,20.29 33.1,23.85 34.52,25.3 34.8,25.58
  pour Bottom: 43.08,47.5 43.79,46.81 44.27,47.5
  pour Top: 30.25,15.11 30,13.82 30.89,14.71
BIAS_ELEC  (via drill 0.38)
  Top 0.152: 39.24,46.1 R24.2 | 29.74,28.45 IC1.62
  Top 0.203: v29.74,29.97 29.74,28.45
  Top 0.356: 39.24,46.1 37.57,45.01 36.15,45.01 34.62,43.04 34.62,39.65 36.2,38.28 JP5.1
  Bottom 0.356: v29.74,29.97 30.35,33.4 33.55,36.5 34.16,37.2 35.19,38.23 36.2,38.23 JP5.1
BIAS_ELEC_CON  (via drill 0.38)
  Top 0.356: R24.1 v35.28,46.96
  Bottom 0.203: v35.28,46.96 20.4,46.96
  Bottom 0.254: J8.24 5.56,33.78 5.59,43.73 6.77,44.91 20.4,46.96
BOARD_ADDR_0  (via drill 0.38)
  Top 0.152: v35.18,21.89 35.18,23.18 35.5,23.5 36.7,23.5 36.96,23.24 38.23,23.24 IC1.42
  Top 0.203: JP0.3 66.02,13.8 65.7,13.49 58.88,13.49 58.56,13.17 R19.2 | R19.2 58.1,11.96 | v57.07,6.07 57.07,6.79 56.76,7.11 IC5.1 | v48.64,13.59 57.07,13.59 v57.78,14.5 58.56,13.73 R19.2
  Bottom 0.152: 38.14,13.49 35.18,16.04 v35.18,21.89
  Bottom 0.203: v48.64,13.59 38.14,13.49 | v57.78,14.5 59.82,11.76 59.71,7.29 v57.07,6.07
  pour Top: 58.39,13.89 58.6,12.88 59.21,13.49
BOARD_ADDR_1  (via drill 0.38)
  Top 0.152: 38.48,24.26 IC1.44
  Top 0.203: 38.48,24.26 40.26,24.26 v40.87,24.41 | R20.2 58.74,6.57 59.06,6.25 62.93,6.25 63.25,6.57 63.25,9.47 JP0.1
  Top 0.305: v53.01,8.31 55.13,8.31 IC5.2 57.82,8.38 R20.2
  Bottom 0.203: v40.87,24.41 41.27,27.41 42.39,29.85 45.59,29.85 51.82,23.5 51.92,18.62 52.91,15.57 52.91,8.41 v53.01,8.31
BOARD_ADDR_2  (via drill 0.38)
  Top 0.152: 38.35,24.69 IC1.45
  Top 0.203: 38.35,24.69 39.29,24.69 40.59,25.27 40.87,25.27 v42.21,25.96 | v50.7,12.12 56.63,12.12 57.02,11.59 57.02,10.9 R21.2
  Top 0.305: IC5.3 R21.2
  Bottom 0.203: v42.21,25.96 42.7,25.63 47.12,25.63 50.55,22.07 50.7,13.87 v50.7,12.12
CLK
  Top 0.203: U2.6 47.86,28.76 40.77,20.68 IC1.37
CLKSEL  (via drill 0.38)
  Top 0.152: v47.37,31.88 48.64,31.88 U2.1 | 34.77,28.32 IC1.52
  Top 0.203: 34.77,28.32 34.75,29.31 v35.08,30.05
  Bottom 0.203: v47.37,31.88 46.1,30.61 35.43,30.61 v35.08,30.05
DRDY
  Top 0.203: U2.3 47.37,30.71 40.1,25.68 IC1.47
DVDD  (via drill 0.38)
  Top 0.152: 49.91,33.91 C52.2 49.66,33.65 | 49.91,35.94 C53.2 | 47.88,33.65 47.88,33.4 R2.1
  Top 0.203: U2.2 48.88,31.37 v50.27,31.37 | v50.11,24.08 50.07,24.12 U3.2 | IC1.48 39.21,26.2 v39.95,26.95 | IC1.50 35.74,29.23 v36.27,29.92 | R2.1 47.73,33.1 | 49.34,15 C56.2 | 49.39,16.65 C57.2 | R3.1 44.68,15.33 v44.68,17.14 | IC9.P$3 44.38,9.77 v44.12,10.03
  Top 0.305: R1.1 v28.96,7.19 | 47.73,33.1 v46.2,33.1 | 49.34,15 v48.59,15.77 49.39,16.65 | C13.1 v40.61,14.73 C14.1 | 49.91,35.94 49.91,33.91 | 47.88,33.65 49.66,33.65 | IC5.8 v52.35,7.14 | R4.1 44.81,6.21 v44.81,5.16 | C70.2 v39.19,11.38 C71.2
  Top 0.356: C25.1 v61.24,33.73 C63.1
  DVDD 0.203: v40.61,14.73 40.61,14.71 | 47.02,7.14 v52.35,7.14
  Bottom 0.203: JP0.4 63.47,14.81
  Bottom 0.254: JP0.4 JP0.2
  Bottom 0.305: v44.68,17.14 47.95,15.8 v48.59,15.77
  pour DVDD: 0,52.27 0,0.97 arc90 0.97,0 98.12,0 arc90 99.06,0.94 99.06,2.54 101.6,5.08 101.6,37.85 99.06,40.39 99.06,51.82 97.54,53.34 0.99,53.34 arc90
GPIO4  (via drill 0.38)
  Top 0.152: v36.45,24.46 36.6,24.51 37.21,25.02 37.46,25.27 38.23,25.27 IC1.46 | 21.46,7.75 R18.1
  Top 0.305: v21.46,8.76 21.46,7.75
  Bottom 0.203: v36.45,24.46 v21.46,8.76
IN1N
  Top 0.254: R35.1 24.94,19.2 IC1.15
IN1P
  Top 0.254: R34.1 25.68,18.69 IC1.16
IN2N
  Top 0.254: R37.1 23.37,20.2 IC1.13
IN2P
  Top 0.254: R36.1 24.44,19.71 IC1.14
IN3N
  Top 0.254: R39.1 21.44,21.2 IC1.11
IN3P
  Top 0.254: R38.1 22.32,20.7 IC1.12
IN4N
  Top 0.254: R41.1 18.51,22.2 IC1.9
IN4P
  Top 0.254: R40.1 20.34,21.7 IC1.10
IN5N
  Top 0.254: R43.1 18.24,23.2 IC1.7
IN5P
  Top 0.254: R42.1 17.06,22.68 IC1.8
IN6N
  Top 0.254: R45.1 16.94,29.44 21.45,24.2 IC1.5
IN6P
  Top 0.254: R44.1 19.82,23.7 IC1.6
IN7N
  Top 0.254: R47.1 23.93,25.18 IC1.3
IN7P
  Top 0.254: R46.1 23.04,24.7 IC1.4
IN8N
  Top 0.254: R49.1 25.76,26.19 IC1.1
IN8P
  Top 0.254: R48.1 24.71,25.73 IC1.2
IOREF  (via drill 0.38)
  Top 0.152: 55.24,35.94 C55.2 | 55.24,33.65 C54.2 | 37.97,5.21 C73.2
  Top 0.203: C59.2 54.29,16.79
  Top 0.305: C73.2 C72.2 41.13,5.32 41.45,5.64 41.45,9.27 | 54.29,16.79 C58.2 v55.93,14.66 | JP14.2 31.95,4.19 37.97,5.21 | C59.2 54.27,17.62 53.21,18.67 53.21,23.8 53.53,24.12 U3.19 57.24,24.12 v57.89,24.33 | U2.19 54.7,31.37 v52.6,31.37 | 55.24,35.94 55.14,35.84 v55.14,34.82 C54.2 | 41.45,9.27 41.45,12.59 41.77,12.9 v45.72,12.9 | IC9.P$7 41.45,9.27 | v49.73,12.88 v57.43,12.9
  Bottom 0.305: v57.89,24.33 57.25,26.72 v52.6,31.37 v55.14,34.82 | v55.93,14.66 v57.43,12.9 | v45.72,12.9 v49.73,12.88
  pour Top: 41.43,9.83 41.43,8.61 41.99,9.25
N$1
  Top 0.152: 66.02,44.83 C4.1 | 66.42,42.8 L2.1
  Top 0.406: L2.1 66.47,42.44 68,42.44 IC3.5 | 66.42,42.8 66.02,44.83 | C5.1 C4.1
N$2
  Top 0.406: C2.1 L1.1 80.23,42.89 IC2.5 C1.1
N$3
  Top 0.203: IC1.28 34.24,15.34
  Top 0.406: 34.24,15.34 34.24,14.47 C17.1
N$4
  Top 0.203: IC1.30 35.24,14.99 C18.1
N$5
  Top 0.203: 33.25,29.85 IC1.55
  Top 0.356: C19.1 C20.1 33.24,31.27 33.25,29.85
N$7
  Top 0.152: 51.94,42.29 IC6.1
  Top 0.203: 52.16,42.1 IC6.1
  Top 0.406: C15.1 L3.1 | C15.1 C16.1 | C15.1 57.53,46.61 57.53,46.8 57.21,47.12 49.71,47.12 48.56,45.7 48.54,41.36 49.09,40.84 51.84,40.84 52.16,41.16 IC6.1
N$8
  Top 0.203: IC1.26 33.24,13.84
  Top 0.356: 33.24,13.84 C21.1
N$9
  Top 0.406: C26.2 49.78,45.96 50.1,46.28 51.84,46.28 52.16,45.96 IC6.5
N$10
  Top 0.152: 49.91,42.8 C26.1
  Top 0.406: 49.91,42.8 50.82,42.8 51.97,43.74 53.66,43.76 53.95,43.5 53.97,42.54 IC6.3
N$11
  Top 0.305: C32.1 71.01,48.03 71.32,47.71 71.32,45.78 71.01,45.47 68.61,45.47 68.3,45.15 IC3.4
N$12
  Top 0.203: 30.58,29.92 30.24,29.3 IC1.61
  Top 0.305: R6.2 32.84,34.16 32.84,32.08 30.58,29.92
N$13
  Top 0.406: C31.1 81.38,46.8 IC2.4
N$14
  Top 0.152: 19.69,7.49 R18.2
  Top 0.305: D2.A 19.69,7.49
N$15
  Top 0.152: 44.83,45.85 R22.1
  Top 0.356: R22.1 44.95,45.02 45.8,44.81 46.3,44.7 46.67,44.61 R23.2 | 44.83,45.85 44.83,46.95 44.51,47.27 41.63,47.27 41.07,46.61 41.07,46.1 IC7.3
N$16  (via drill 0.38)
  Top 0.152: 29.34,42.09 IC8.3
  Top 0.356: v28.32,42.09 29.34,42.09
  Bottom 0.152: 22.99,42.29 JP6.2
  Bottom 0.305: v28.32,42.09 27.3,43.31 24,43.31 22.99,42.29
N$17  (via drill 0.38)
  Top 0.152: 29.34,43.92 IC8.1 | 32.18,42.14 IC8.4
  Top 0.356: 29.34,43.92 24.83,43.92 24.31,43.4 24.31,40.61 JP7.3 | v30.91,42.14 32.18,42.14
  Bottom 0.305: v30.91,42.14 29.34,43.81 22.48,43.81 21.72,43 21.74,40.5 22.26,40.08 24.41,40.11 25.53,38.73 JP7.3
N$18  (via drill 0.38)
  Top 0.152: 42.95,45.92 IC7.1
  Top 0.203: v42.95,44.58 42.95,45.92
  Top 0.356: JP5.3 IC7.4
  Bottom 0.356: v42.95,44.58 41.3,43.33 38.61,43.31 JP5.3
N$19
  Top 0.152: 23.75,7.24 R1.2 | 23.75,5.21 D1.A
  Top 0.305: 23.75,5.21 23.75,7.24
N$22
  Top 0.406: C66.2 32.12,37.87 R6.1
N$25
  Top 0.203: 29.01,29.64 29.24,29.44 IC1.63
  Top 0.254: C66.1 28.78,36.23 28.78,29.85 29.01,29.64
N$37
  Top 0.203: IC9.P$6 43.14,9.77 43.46,9.46 43.46,7.9 43.04,7.48 R4.2
N$561  (via drill 0.38)
  Top 0.152: 48.74,26.19 U2.10 | 47.62,34.92 R2.2
  Top 0.203: v47.73,26.19 48.74,26.19
  Top 0.305: v43.66,29.08 45.21,30.66 45.21,33.17 46.53,34.92 47.62,34.92
  Bottom 0.305: v47.73,26.19 44.83,29.08 v43.66,29.08
N$562
  Top 0.152: 48.77,18.92 U3.10
  Top 0.203: 48.77,18.92 43.26,18.92 42.94,18.61 R3.2
REF_ELEC
  Top 0.152: 15.87,40.61 C62.1
  Top 0.254: 14.9,40.82 C62.1 | 20.45,40.61 15.87,40.61 | JP6.1 20.45,40.61 | 20.45,40.61 20.45,38.73 JP7.1
  Top 0.305: R25.1 14.9,40.82
  pour Top: 19.86,40.61 20.45,40.16 20.45,41.12
REF_ELEC_CON
  Top 0.254: J8.23 5.91,32.54 5.59,32.85 5.59,41.77 5.91,42.09 10.07,42.09 R25.2
SCL  (via drill 0.38)
  Top 0.203: IC5.6 48.63,9.65 48.31,9.97 v48.31,10.21 | v45.54,11.33 IC9.P$4
  Bottom 0.203: v48.31,10.21 v45.54,11.33
SDA  (via drill 0.38)
  Top 0.203: IC9.P$5 42.65,10.3 v42.65,12.06 | v49.12,12.06 49.69,12.06 50,11.75 IC5.5
  Bottom 0.203: v42.65,12.06 v49.12,12.06
SPI0_MISO
  Top 0.203: SPI.1 63.5,32.85 64.05,33.32 77.36,33.32 77.65,33.01 JP2.2
SPI0_MOSI
  Top 0.203: SPI.4 65,28.85 65,32.14 65.32,32.46 75.88,32.46 76.2,32.17 76.2,23.37 76.56,21.69 76.56,11.05 JP2.18
SPI0_SCK
  Top 0.203: JP2.8 76.56,23.85 76.56,32.58 76.16,32.89 64.88,32.89 64.57,32.58 64.57,28.88 SPI.3
SPI_CLK
  Top 0.203: U2.5 47.72,29.41 41.15,22.2 IC1.40
SPI_IN
  Top 0.203: U2.7 48.1,28.11 40.39,19.2 IC1.34
SPI_OUT
  Top 0.203: U2.4 47.46,30.06 41.66,23.7 IC1.43
SRB1  (via drill 0.38)
  Top 0.152: 29.23,16.33 IC1.18 | 23.24,37.67 JP7.2
  Top 0.203: 29.23,16.33 29.23,15.62 28.96,15.39 28.41,15.39 28.09,15.73 28.09,26.09 27.28,27.18 24.99,28.75 24.36,29.74 24.36,32.49 23.24,34.16 | 23.24,37.67 23.24,34.16 | 23.24,34.16 v26.04,34.95
  Bottom 0.356: v26.04,34.95 27.05,34.92 30.02,34.95 36.2,40.77 JP5.2
  pour Top: 23.62,33.48 23.27,34.21 23.16,34.92
  pour Top: 23.24,34.92 23.88,34.37 23.6,33.63 23.16,34.16
SRB2  (via drill 0.38)
  Top 0.203: v29.13,21.21 28.74,19.8 IC1.17
  Bottom 0.203: v29.13,21.21 29.13,24.77 27.92,26.9 27.92,28.31 27.5,28.63 25.18,28.63 24.87,28.94 24.92,35.41 27.25,37.29 27.36,40.31 JP6.3
START  (via drill 0.38)
  Top 0.203: U3.3 48.87,23.5 v46.08,23.5 | v40.18,21.46 39.92,21.2 IC1.38
  Bottom 0.305: v46.08,23.5 v40.18,21.46
USART1_MISO
  Top 0.203: JP2.4 77.57,27.69 78.92,28.85 78.94,36.69 78.27,37.36 76.89,37.36 74.65,39.6 74.65,45.09 72.26,47.47 72.26,51.78 72.56,52.09 75.88,52.09 76.07,51.88 JP10.4
USART1_MOSI
  Top 0.203: JP2.20 80.3,7.47 80.92,8.32 80.9,37.1 79.67,38.1 77.27,38.1 75.46,39.9 75.46,45.26 73.53,47.19 JP10.3
USART1_SCK
  Top 0.203: JP13.1 50.67,4.97 50.99,5.28 68.48,5.28 69.06,5.87 75.91,5.87 76.38,6.21 76.38,8.19 76.85,8.79 79.23,8.81 79.98,9.59 80.01,23.14 JP2.6
VCC_5V  (via drill 0.6)
  Top 0.406: v76.71,35.46 C27.1 74,35.79 L4.1
  Bottom 0.406: SPI.2 69.77,30.35 v76.71,35.46
VCC_5V_FILTERED
  Top 0.406: 53.11,39.6 IC6.2 | 53.11,39.6 53.18,39.53 C64.1 C65.1 JP3.1 61.95,37.74 L4.2 70.9,37.75 IC3.1 71.79,42.38 72.11,42.7 72.11,43.96 71.79,44.28 IC3.3 | C68.1 53.11,39.6
  pour Top: 70.89,38.48 70.08,37.67 71.7,37.67
VCC_-5V  (via drill 0.38)
  Top 0.152: 61.09,46.61 L3.2
  Top 0.305: C24.1 58.19,41.93
  Top 0.406: 82.8,44.78 v82.68,44.83 82.72,44.79 IC2.3 | 58.19,41.93 v58.9,42.65 | 61.09,46.61 v62.1,46.61 | C28.1 86.88,45.49 86.18,44.79 IC2.3 | IC2.2 IC2.3
  Bottom 0.406: v82.68,44.83 81.31,45.49 66.4,45.49 64.92,46.81 62.69,46.81 v62.1,46.61 59.22,46.61 58.9,46.29 v58.9,42.65
VREFP
  Top 0.203: IC1.24 32.24,15.35 31.55,14.68
  Top 0.305: C22.1 C23.1 30.56,13.66 31.55,14.68
(copper drawn outside any net)
  shapes: Bottom circle x1

## Text on the board
Bottom: C 2013 / Adam Feuer
tPlace: 5V | SCL1 | SDA1 | AREF | GND | 13 | 12 | 11 | 10 | 9 | 8 | 7 | 6 | 5 | 4 | 3 | 2 | 1 | 0 | 14 | 15 | 16 | 17 | 18 | 19 | 20 | 21 | 22 | 23 | External / Sync | 24 | 3 | 1 | 2 | 3 | 25 | AVSS | 3 | 26 | 3 | 2 | 27 | 29 | 30 | 2 | 2 | 1 | 28 | 29 | 30 | 1 | 1 | AVDD | A | B | 31 | 1 | 2 | 3 | AGND | 32 | 12 | 33 | 34 | A | B | PWDN | 11 | 35 | 36 | 10 | 10 | 37 | 38 | SPI / MISO | 9 | 9 | RESET | 39 | 40 | 8 | 8 | 41 | 42 | v1.1 | SPI / CLK | 7 | START | 7 | A | B | 43 | 44 | 6 | 6 | 45 | 5 | CLK | 46 | Jumper / Storage | 5 | 47 | 48 | 0 | SPI CS | 4 | 4 | 49 | Electrodes | 50 | 1 | 3 | 3 | 51 | 52 | Board Addr | 2 | DRDY | 2 | 53 | GND | GND | SPI / MOSI | HackEEG Shield | 1 | 1 | 1 | 2 | 5V | GND | VIN | IOREF | RESET | 3V3 | A0 | A1 | A2 | A3 | A4 | A5 | A6 | A7 | A8 | A9 | A10 | A11 | A12 | A13 | A14 | A15 | GPIO4 | Power
bPlace: Released under a Creative Commons / Attribution-ShareAlike 4.0 Unported / (CC BY-SA 4.0) license